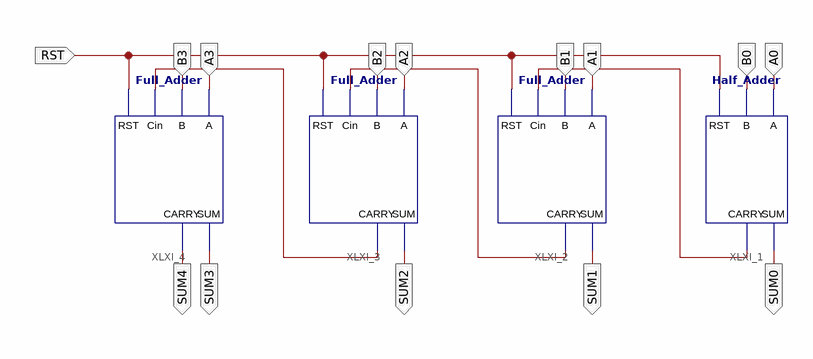
[diagram p0: schematic sheet 1]
// Xilinx ISE schematic Adder_4_Bit.sch (spartan6) as structural Verilog: 4 symbols, 14 ports
module Adder_4_Bit (
  input  RST,
  input  A3,
  input  B3,
  input  B2,
  input  A2,
  input  B1,
  input  A1,
  input  B0,
  input  A0,
  output SUM4,
  output SUM3,
  output SUM2,
  output SUM1,
  output SUM0
);

  wire XLXN_3, XLXN_4, XLXN_6;

  Half_Adder XLXI_1 (.A(A0), .B(B0), .CARRY(XLXN_6), .RST(RST), .SUM(SUM0));
  Full_Adder XLXI_2 (.A(A1), .B(B1), .CARRY(XLXN_3), .Cin(XLXN_6), .RST(RST), .SUM(SUM1));
  Full_Adder XLXI_3 (.A(A2), .B(B2), .CARRY(XLXN_4), .Cin(XLXN_3), .RST(RST), .SUM(SUM2));
  Full_Adder XLXI_4 (.A(A3), .B(B3), .CARRY(SUM4), .Cin(XLXN_4), .RST(RST), .SUM(SUM3));
endmodule
